# EasyEDA schematic SCH_atmega-328-basic_2025-07-23.json
TITLE: Sheet_1; REV: 1.0; Date: 19-21-25; Sheet: 1/1; Drawn By: SAMEERROSHAN(SR5); Company: Your Company
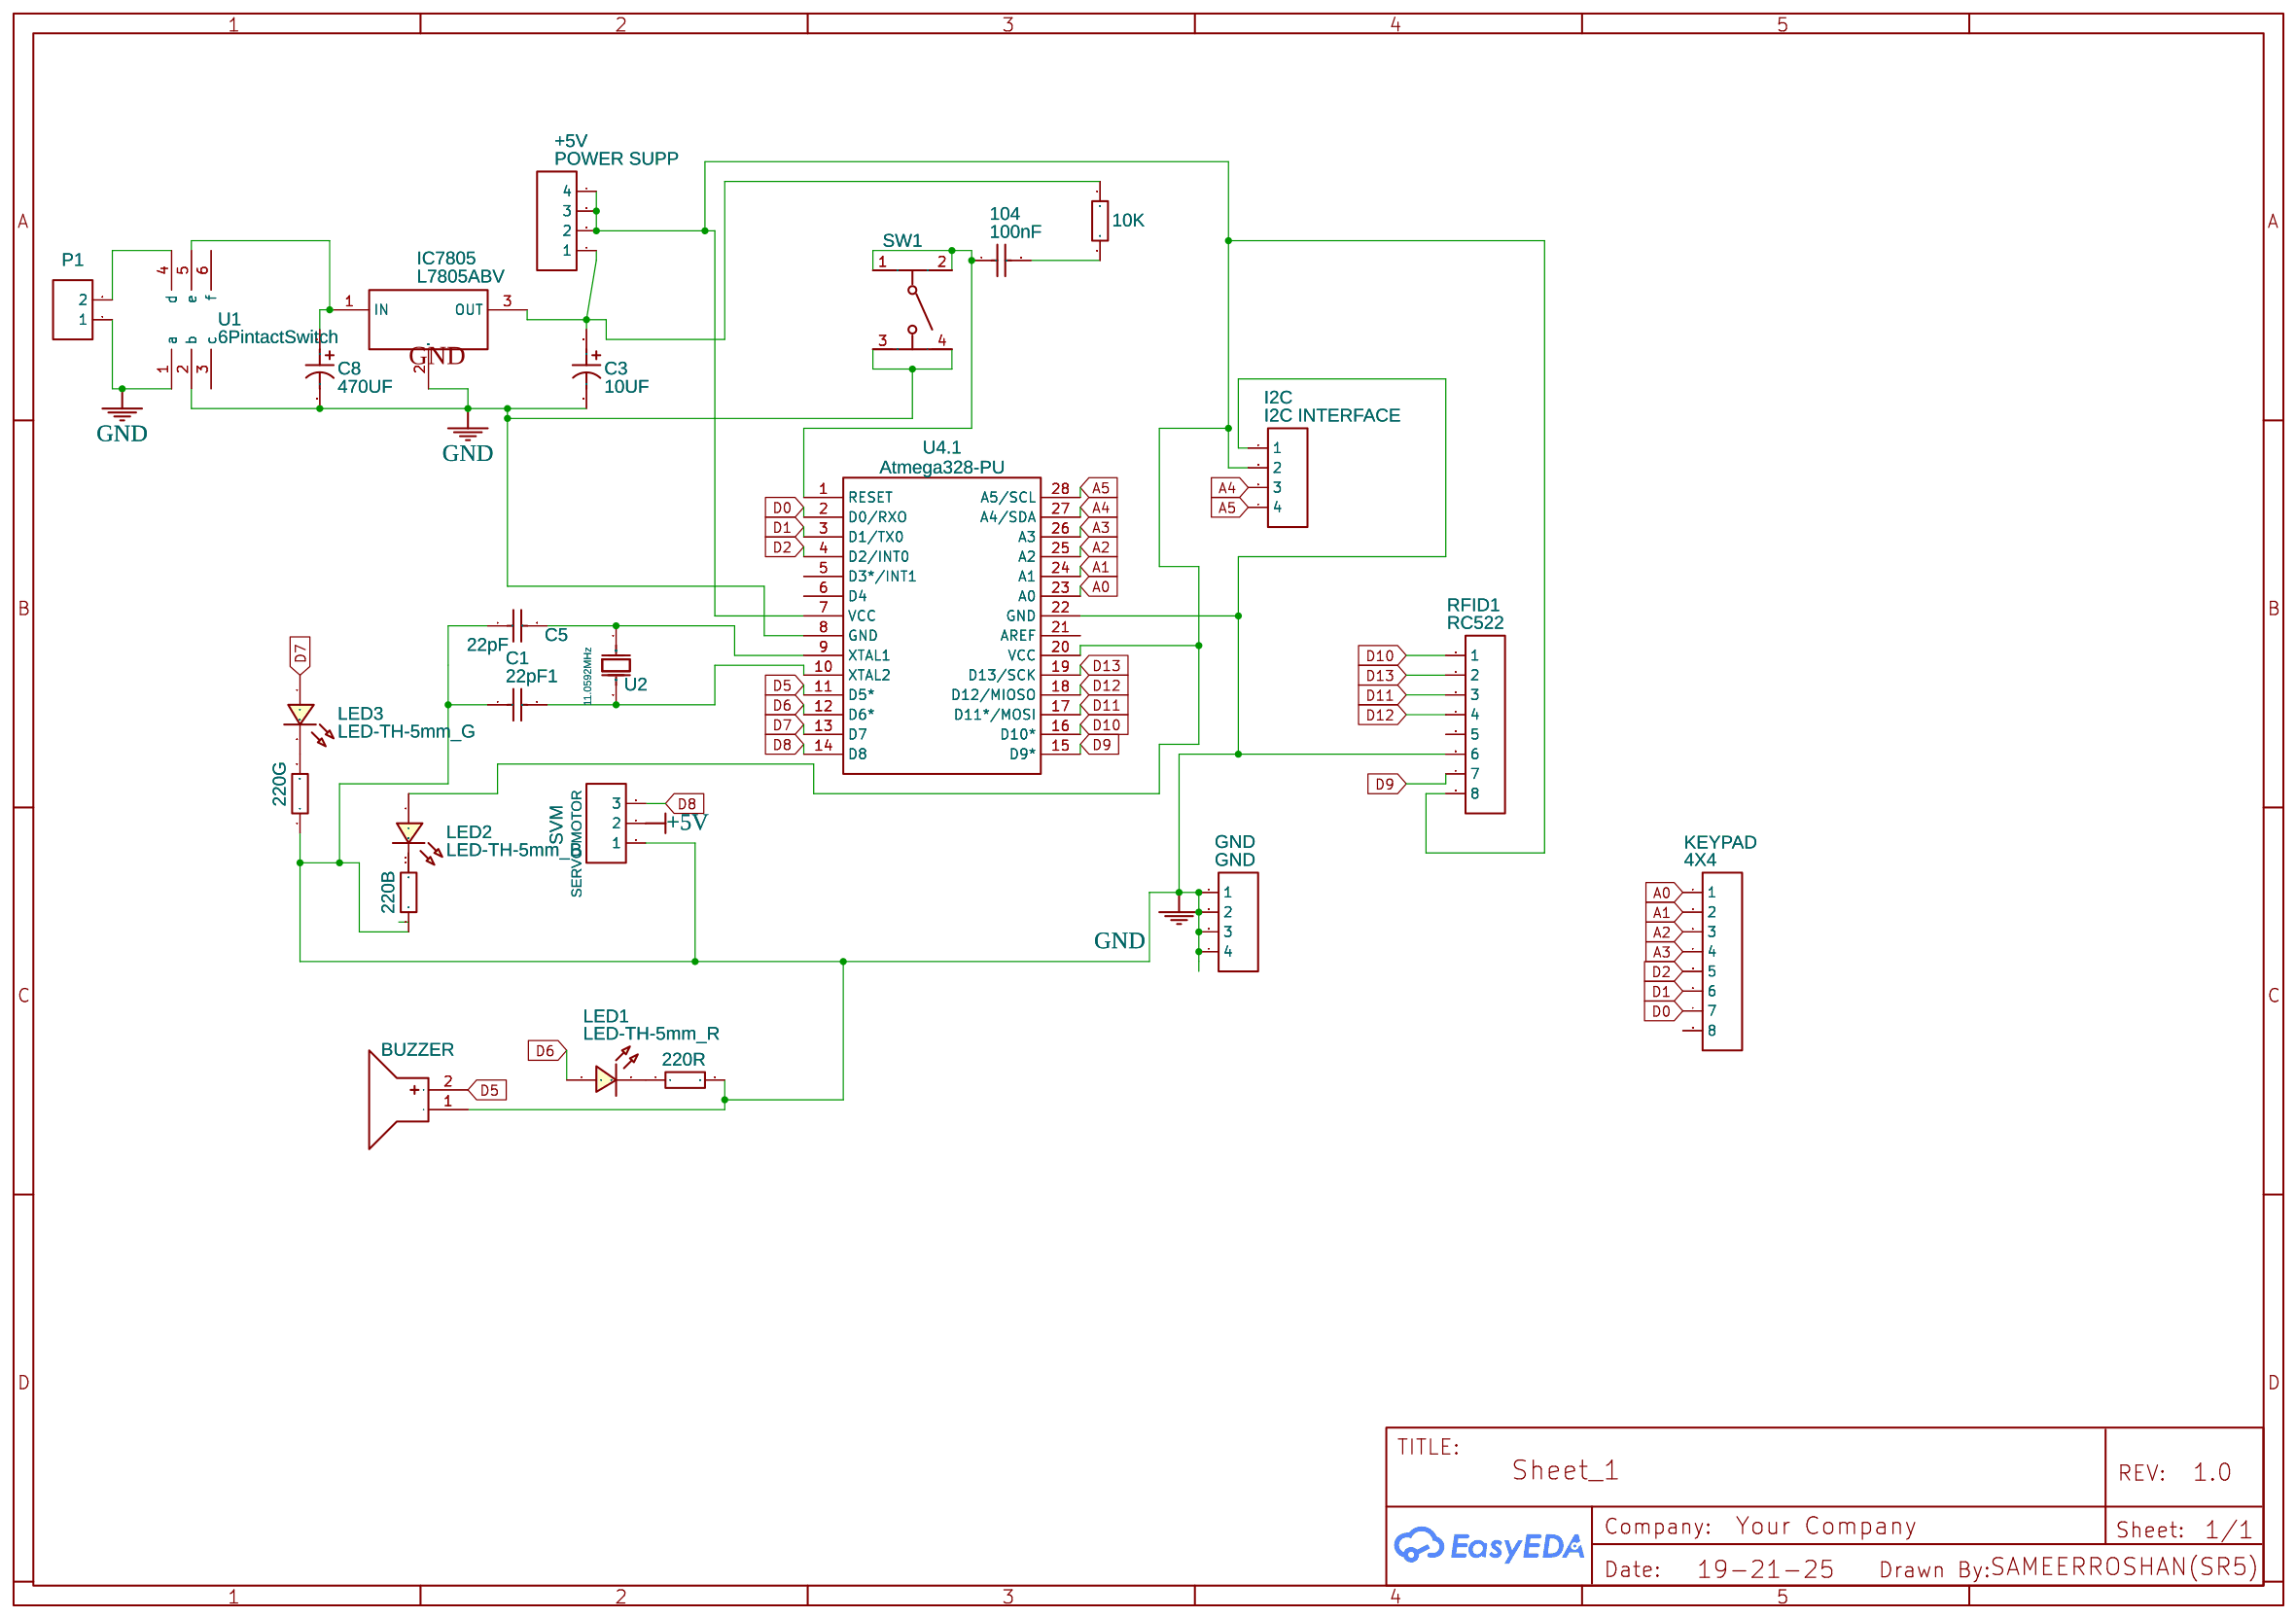
[diagram p0: schematic sheet]

## Parts
10K  1kΩ  [RES-TH_BD2.4-L6.3-P10.30-D0.6]
104  100nF  [CAP-TH_L3.5-W3.0-P2.54-D0.8]
220B  1kΩ  [RES-TH_BD2.4-L6.3-P10.30-D0.6]
220G  1kΩ  [RES-TH_BD2.4-L6.3-P10.30-D0.6]
220R  1kΩ  [RES-TH_BD2.4-L6.3-P10.30-D0.6]
+5V  POWER SUPP  [HDR-F-2.54_1X4]
BUZZER1  BUZZER  [BUZ-TH_BD12.0-P6.00-D0.9-RD]
C1  22pF1  [CAP-TH_L3.5-W3.0-P2.54-D0.8]
C3  10UF  [CAP-TH_BD8.0-P3.50-D0.5-FD]
C5  22pF  [CAP-TH_L3.5-W3.0-P2.54-D0.8]
C8  470UF  [CAP-TH_BD8.0-P3.50-D0.5-FD]
GND  GND  [HDR-F-2.54_1X4]
I2C  I2C INTERFACE  [HDR-F-2.54_1X4]
IC7805  L7805ABV  [TO-220-3_L10.0-W4.5-P2.54-L]
KEYPAD  4X4  [HDR-F-2.54_1X8]
LED1  LED-TH-5mm_R  [LED-TH_BD5.0_RED]
LED2  LED-TH-5mm_B  [LED-TH_BD5.0_BLUE]
LED3  LED-TH-5mm_G  [LED-TH_BD5.0_GREEN]
P1  CONN-TH_2P-P5.00  [CONN-TH_2P-P5.00]
RFID1  RC522  [HDR-F-2.54_1X8]
SVM  SERVO MOTOR  [HDR-F-2.54_1X3]
SW1  Button-6x6x6mm  [SW-TH_4P-L6.0-W6.0-P4.50-LS6.1]
U1  6PintactSwitch  [6PINTACTSWITCHFOOT]
U2  11.0592MHz  [HC-49US_L11.5-W4.5-P4.88]
U4  Atmega328-PU  [ATMEGA328-PU]  (section 1)

## Library data of the parts
10K 220B 220G 220R = FMP100FRF52-1K: Contributor: lcsc; Supplier: LCSC; Supplier Part: C1754925; Manufacturer: YAGEO(国巨); link: https://lcsc.com/eda_search?q=C1754925&%26type=1&ref=editor
104 C1 C5 = 22pf/50V 10%: Supplier: LCSC; Manufacturer: ReliaPro; Supplier Part: C9316
+5V GND I2C = HDR-F-2.54_1x4: Supplier Part: C225501; Supplier: LCSC; Contributor: LCEDA_Lib
BUZZER1 = BUZZER: Contributor: lcsc; Supplier: LCSC; Supplier Part: C9900014030; Manufacturer: null; Manufacturer Part: buzzer; JLCPCB Part Class: Extended Part; link: https://lcsc.com/eda_search?q=C9900014030&%26type=1&ref=editor
C3 C8 = 27UF400V87EC0275: Contributor: lcsc; Supplier: LCSC; Supplier Part: C2803207; Manufacturer: KNSCHA(科尼盛); JLCPCB Part Class: Extended Part; link: https://lcsc.com/eda_search?q=C2803207&%26type=1&ref=editor
IC7805 = L7805ABV: Supplier: LCSC; Manufacturer: ST(意法半导体); Supplier Part: C16807; JLCPCB Part Class: Extended Part; link: https://lcsc.com/eda_search?q=C16807&%26type=1&ref=editor
KEYPAD RFID1 = HDR-F-2.54_1x8: Supplier Part: C225505; Supplier: LCSC; Contributor: LCEDA_Lib
LED1 = LED-TH-5mm_R: Manufacturer: EVERLIGHT(台湾亿光); Manufacturer Part: 333-2SURD/S530-A3; Supplier Part: C87271; Supplier: LCSC; Contributor: LCEDA_Lib
LED2 = LED-TH-5mm_B: Supplier: LCSC; Contributor: LCEDA_Lib
LED3 = LED-TH-5mm_G: Manufacturer: EVERLIGHT(台湾亿光); Manufacturer Part: 333-2SYGD/S530-E2; Supplier Part: C88163; Supplier: LCSC; Contributor: LCEDA_Lib
P1 = CONN-TH_2P-P5.00: Supplier: LCSC; Contributor: LCEDA_Lib
SVM = HDR-F-2.54_1x3: Supplier Part: C146690; Supplier: LCSC; Contributor: LCEDA_Lib
SW1 = Button-6x6x6mm: Supplier Part: C71836; Supplier: LCSC; Manufacturer: BBJ; Manufacturer Part: Switch,6*6*6Plastic head,260G, 0.25mm,Straight line; link: https://lcsc.com/eda_search?q=C71836&%26type=1&ref=editor
U1 = 6PintactSwitch: Contributor: ehsan1903073
U2 = ECS-120-32-4X: Contributor: lcsc; Supplier: LCSC; Supplier Part: C2636148; Manufacturer: ECS; link: https://lcsc.com/eda_search?q=C2636148&%26type=1&ref=editor
U4 = Atmega328-PU: Contributor: Sopian; sourceId: 3rfdaKkiS; subpart_no: 1

## Nets
+5V: SVM.2
GND: 220B.1 220G.1 220R.2 BUZZER1.1(-) C1.1 C3.2 C5.1 C8.2 GND.1 GND.2 GND.3 GND.4 I2C.1 IC7805.2(GND) P1.1 RFID1.6 SVM.1 SW1.3 SW1.4 U1.1(a) U1.2(b) U4.8(GND) U4.22(GND)
A0: KEYPAD.1 U4.23(A0)
A1: KEYPAD.2 U4.24(A1)
A2: KEYPAD.3 U4.25(A2)
A3: KEYPAD.4 U4.26(A3)
A4: I2C.3 U4.27(A4/SDA)
A5: I2C.4 U4.28(A5/SCL)
D0: KEYPAD.7 U4.2(D0/RXO)
D1: KEYPAD.6 U4.3(D1/TX0)
D2: KEYPAD.5 U4.4(D2/INT0)
D5: BUZZER1.2(+) U4.11(D5*)
D6: LED1.1 U4.12(D6*)
D7: LED3.1 U4.13(D7)
D8: SVM.3 U4.14(D8)
D9: RFID1.7 U4.15(D9*)
D10: RFID1.1 U4.16(D10*)
D11: RFID1.3 U4.17(D11*/MOSI)
D12: RFID1.4 U4.18(D12/MIOSO)
D13: RFID1.2 U4.19(D13/SCK)
Net-(10K-1): 10K.1 +5V.1 C3.1 IC7805.3(OUT)
Net-(10K-2): 10K.2 104.2
Net-(104-1): 104.1 SW1.1 SW1.2 U4.1(RESET)
Net-(220B-2): 220B.2 LED2.2
Net-(220G-2): 220G.2 LED3.2
Net-(220R-1): 220R.1 LED1.2
Net-(+5V-2): +5V.2 +5V.3 +5V.4 I2C.2 LED2.1 RFID1.8 U4.7(VCC) U4.20(VCC)
Net-(C1-2): C1.2 U2.2(OSC2) U4.10(XTAL2)
Net-(C5-2): C5.2 U2.1(OSC1) U4.9(XTAL1)
Net-(C8-1): C8.1 IC7805.1(IN) U1.5(e)
Net-(P1-2): P1.2 U1.4(d)

Not connected (* = marked no-connect by the designer): KEYPAD 8; RFID1 5; U1 3(c) 6(f); U4 5(D3*/INT1) 6(D4) 21(AREF)
